# Altium schematic sheet Tesla_Giraffe.SchDoc: Tesla Giraffe
size Letter; Engineer: JCT; SheetNumber: 1; SheetTotal: 1
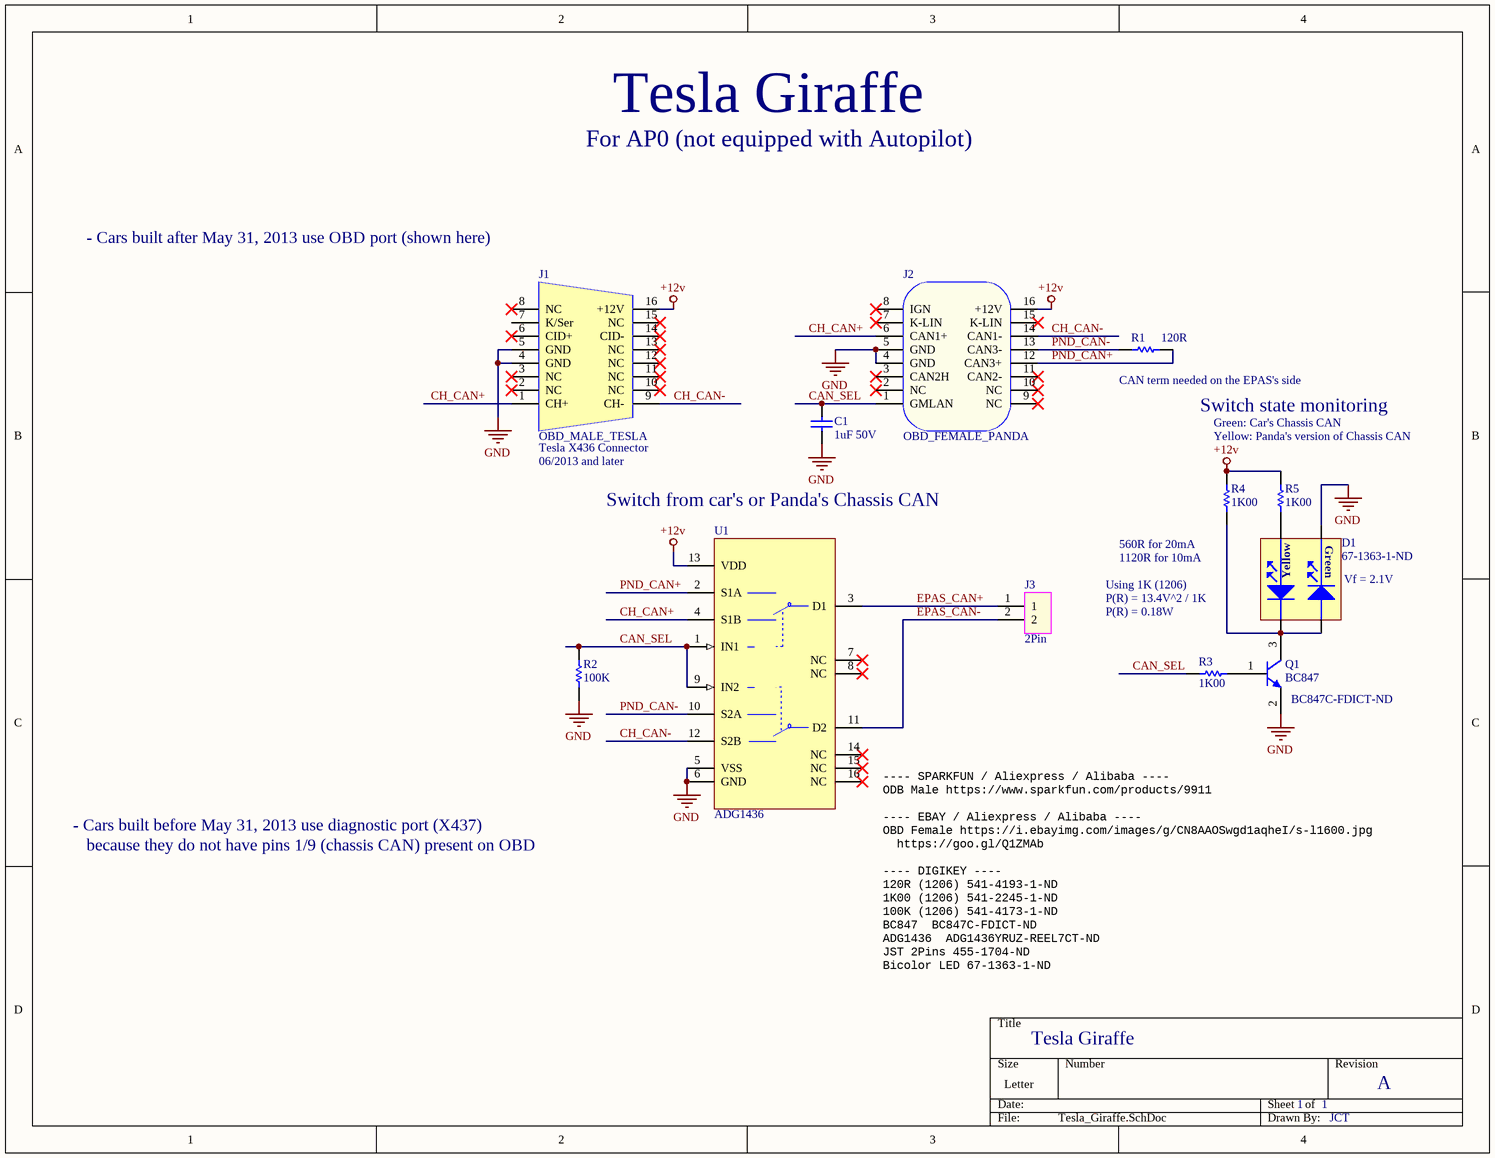
[diagram p0: Tesla_Giraffe.SchDoc]

## Parts
C1  1uF 50V  [R_1206]
D1  67-1363-1-ND  [LED_BICOLOR_1210]
J1  OBD_MALE_TESLA  [OBD_MALE]
J2  OBD_FEMALE_PANDA  [OBD_FEMALE]
J3  2Pin  [JST_PH_2PINS]
Q1  BC847  [SOT23-3N]
R1  120R  [R_1206]
R2  100K  [R_1206]
R3  1K00  [R_1206]
R4  1K00  [R_1206]
R5  1K00  [R_1206]
U1  ADG1436  [TSSOP16]

## Nets
+12v: J1.16(+12V) J2.16(+12V) R4.2 R5.2 U1.13(VDD)
GND: C1.1 D1.2C(CATHODE2) J1.4(GND) J1.5(GND) J2.4(GND) J2.5(GND) Q1.2(E) R2.1 U1.5(VSS) U1.6(GND)
CAN_SEL: C1.2 J2.1(GMLAN) R2.2 R3.2 U1.1(IN1) U1.9(IN2)
CH_CAN+: J1.1(CH+) J2.6(CAN1+) U1.4(S1B)
CH_CAN-: J1.9(CH-) J2.14(CAN1-) U1.12(S2B)
EPAS_CAN+: J3.1 U1.3(D1)
EPAS_CAN-: J3.2 U1.11(D2)
PND_CAN+: J2.12(CAN3+) R1.2 U1.2(S1A)
PND_CAN-: J2.13(CAN3-) R1.1 U1.10(S2A)
NetD1_1A: D1.1A(ANODE1) R5.1
NetD1_1C: D1.1C(CATHODE1) D1.2A(ANODE2) Q1.3(C) R4.1
NetQ1_1: Q1.1(B) R3.1

Not connected (* = marked no-connect by the designer): J1 2(NC)* 3(NC)* 6(CID+)* 7(K/Ser) 8(NC)* 10(NC)* 11(NC)* 12(NC)* 13(NC)* 14(CID-)* 15(NC)*; J2 2(NC)* 3(CAN2H)* 7(K-LIN)* 8(IGN)* 9(NC)* 10(NC)* 11(CAN2-)* 15(K-LIN)*; U1 7(NC)* 8(NC)* 14(NC)* 15(NC)* 16(NC)*

## Notes on the sheet
- For AP0 (not equipped with Autopilot)
- - Cars built after May 31, 2013 use OBD port (shown here)
- (near R1) CAN term needed on the EPAS's side
- Switch state monitoring
- Green: Car's Chassis CAN
- (near J1) Tesla X436 Connector
- (near J1) 06/2013 and later
- Switch from car's or Panda's Chassis CAN
- Yellow: Panda's version of Chassis CAN
- (near R4) 560R for 20mA
- (near R4) 1120R for 10mA
- Using 1K (1206)
- P(R) = 13.4V^2 / 1K
- P(R) = 0.18W
- (near D1) Vf = 2.1V
- (near Q1) BC847C-FDICT-ND
- - Cars built before May 31, 2013 use diagnostic port (X437)
- because they do not have pins 1/9 (chassis CAN) present on OBD
- (near U1) ---- SPARKFUN / Aliexpress / Alibaba ----
  ODB Male	https://www.sparkfun.com/products/9911
  ---- EBAY / Aliexpress / Alibaba ----
  OBD Female	https://i.ebayimg.com/images/g/CN8AAOSwgd1aqheI/s-l1600.jpg
  https://goo.gl/Q1ZMAb
  ---- DIGIKEY ----
  120R (1206)	541-4193-1-ND
  1K00 (1206)	541-2245-1-ND
  100K (1206)	541-4173-1-ND
  BC847		BC847C-FDICT-ND
  ADG1436		ADG1436YRUZ-REEL7CT-ND
  JST 2Pins	455-1704-ND
  Bicolor LED	67-1363-1-ND
- Tesla Giraffe
- 1
- A
- JCT
- (in symbol SML-LX1210YGC-TR) Green; Yellow

## Library data of the parts
C1 = CAPACITOR NP: Capacitor (Semiconductor SIM Model)
D1 = SML-LX1210YGC-TR: SMD Dual (Green-Yellow) Led in a 1210 package; Manufacturer: Lumex; Part_type: Diode/LED/Dual; Catalog_part_number: 67-1363-2-ND; Catalog_name: Digikey; Part_number: SML-LX1210YGC-TR; Value: SML-LX1210YGC-TR; ComponentLink1Description: Datasheet
J1 = OBD_MALE_TESLA: OBD Male connector
J2 = OBD_FEMALE_PANDA: OBD Female connector
Q1 = NPN: NPN Bipolar Transistor
R1-R5 = RESISTOR: Semiconductor Resistor
U1 = ADG1436: 1.5 Ω On Resistance,  ±15 V/12 V/±5 V, iCMOS, Dual SPDT Switch